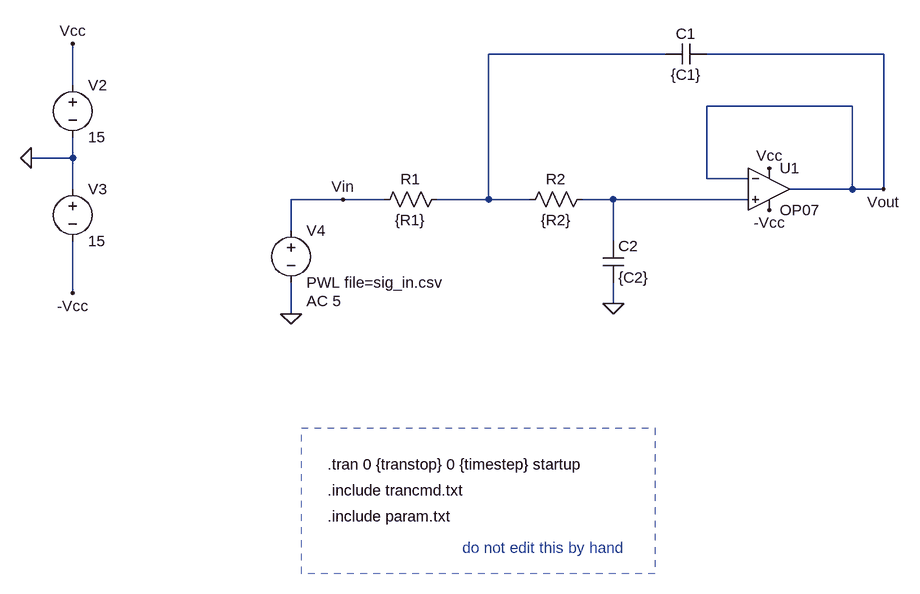
[diagram p0: schematic A3_BajaSK_2.asc]
A3_BajaSK_2.asc, the LTspice schematic file:
Version 4
SHEET 1 2472 680
WIRE 1936 -464 1664 -464
WIRE 2272 -464 2000 -464
WIRE 1024 -416 1024 -480
WIRE 2224 -384 2000 -384
WIRE 1024 -304 1024 -336
WIRE 1024 -304 960 -304
WIRE 2000 -272 2000 -384
WIRE 2064 -272 2000 -272
WIRE 1024 -256 1024 -304
WIRE 2224 -256 2224 -384
WIRE 2224 -256 2128 -256
WIRE 2272 -256 2272 -464
WIRE 2272 -256 2224 -256
WIRE 1440 -240 1360 -240
WIRE 1504 -240 1440 -240
WIRE 1664 -240 1664 -464
WIRE 1664 -240 1584 -240
WIRE 1728 -240 1664 -240
WIRE 1856 -240 1808 -240
WIRE 2064 -240 1856 -240
WIRE 1360 -192 1360 -240
WIRE 1856 -176 1856 -240
WIRE 1024 -96 1024 -176
WIRE 1856 -80 1856 -112
WIRE 1360 -64 1360 -112
FLAG 2272 -256 Vout
FLAG 1856 -80 0
FLAG 1440 -240 Vin
FLAG 960 -304 0
FLAG 1024 -480 Vcc
FLAG 1024 -96 -Vcc
FLAG 2096 -288 Vcc
FLAG 2096 -224 -Vcc
FLAG 1360 -64 0
SYMBOL res 1600 -256 R90
WINDOW 0 0 56 VBottom 2
WINDOW 3 32 56 VTop 2
SYMATTR InstName R1
SYMATTR Value {R1}
SYMBOL cap 1936 -448 R270
WINDOW 0 32 32 VTop 2
WINDOW 3 0 32 VBottom 2
SYMATTR InstName C1
SYMATTR Value {C1}
SYMBOL OpAmps\\OP07 2096 -320 R0
SYMATTR InstName U1
SYMBOL cap 1840 -176 R0
SYMATTR InstName C2
SYMATTR Value {C2}
SYMBOL voltage 1024 -432 R0
WINDOW 123 0 0 Left 0
WINDOW 39 0 0 Left 0
SYMATTR InstName V2
SYMATTR Value 15
SYMBOL voltage 1024 -272 R0
WINDOW 123 0 0 Left 0
WINDOW 39 0 0 Left 0
SYMATTR InstName V3
SYMATTR Value 15
SYMBOL voltage 1360 -208 R0
WINDOW 123 24 124 Left 2
WINDOW 39 0 0 Left 0
SYMATTR Value2 AC 5
SYMATTR InstName V4
SYMATTR Value PWL file=sig_in.csv
SYMBOL res 1824 -256 R90
WINDOW 0 0 56 VBottom 2
WINDOW 3 32 56 VTop 2
SYMATTR InstName R2
SYMATTR Value {R2}
TEXT 1416 168 Left 2 !.tran 0 {transtop} 0 {timestep} startup
TEXT 1416 248 Left 2 !.include param.txt
TEXT 1416 208 Left 2 !.include trancmd.txt
TEXT 1624 296 Left 2 ;do not edit this by hand
RECTANGLE Normal 1920 336 1376 112 2

The netlist it stands for:
* A3_BajaSK_2.asc
R1 N001 Vin {R1}
C1 N001 Vout {C1}
XU1 N002 Vout Vcc -Vcc Vout LT1001  ; OP07, pins In+ In- V+ V- OUT
C2 N002 0 {C2}
V2 Vcc 0 15
V3 0 -Vcc 15
V4 Vin 0 PWL file=sig_in.csv AC 5
R2 N002 N001 {R2}
.tran 0 {transtop} 0 {timestep} startup
.include param.txt
.include trancmd.txt
* do not edit this by hand
.lib LTC.lib
.backanno
.end

* Results of the author's LTspice run, read from the files saved beside the schematic
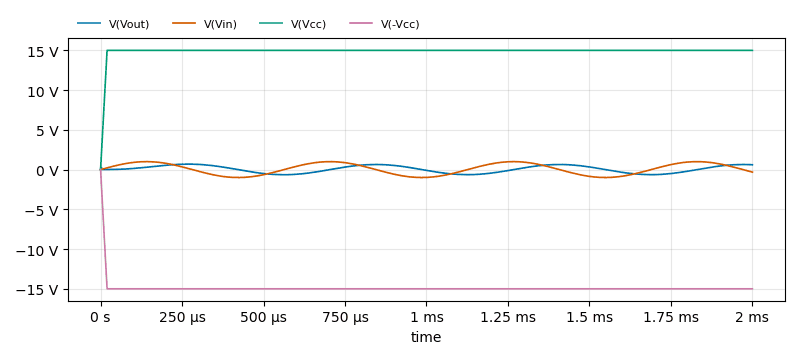
[diagram p1: Transient Analysis of A3_BajaSK_2.asc, plotted from the saved traces]
* Transient Analysis, 1 run:
*   V(Vout): min -647.6 mV, max 687.3 mV, average 54.23 mV, rms 451.5 mV, last 607.2 mV
*   V(Vin): min -1 V, max 1 V, average 87.26 mV, rms 702.9 mV, last -319.2 mV
*   V(Vcc): min 0 V, max 15 V, average 14.92 V, rms 14.95 V, last 15 V
*   V(-Vcc): min -15 V, max 0 V, average -14.92 V, rms 14.95 V, last -15 V